# Altium schematic sheet HW_Control.SchDoc
size A4; DocumentNumber: 7; SheetNumber: 7; SheetTotal: 11
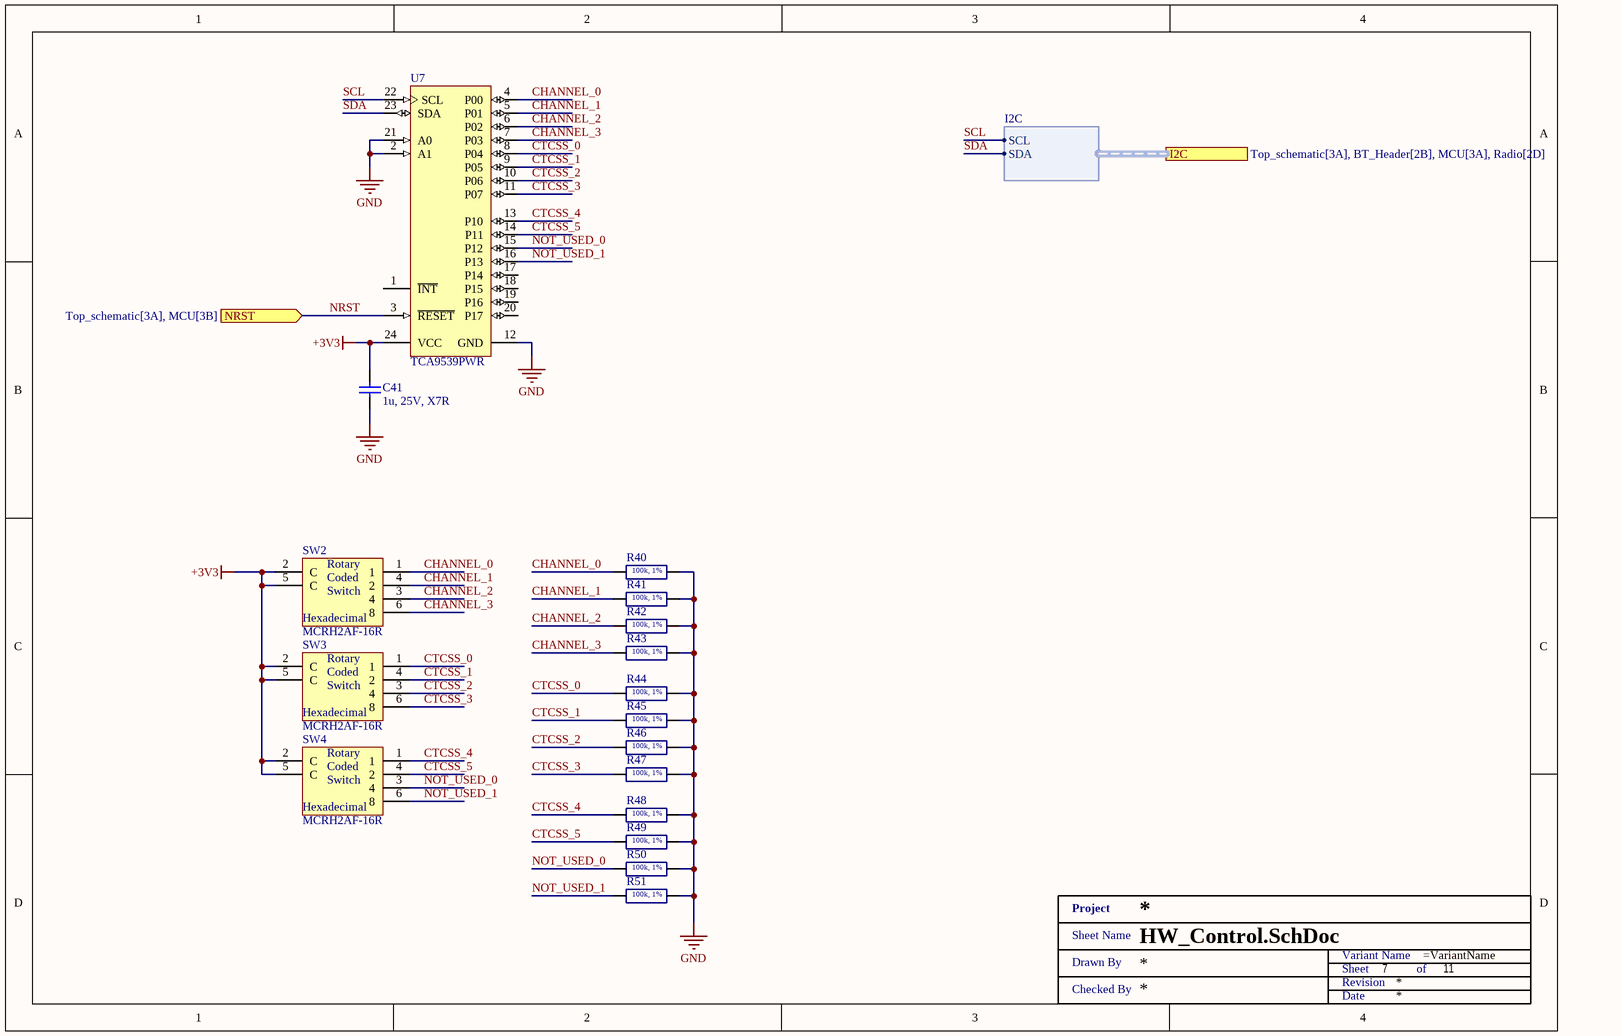
[diagram p0: HW_Control.SchDoc]

## Parts
C41  1u, 25V, X7R  [SMD0603]
R40  100k, 1%  [SMD0603 - R]
R41  100k, 1%  [SMD0603 - R]
R42  100k, 1%  [SMD0603 - R]
R43  100k, 1%  [SMD0603 - R]
R44  100k, 1%  [SMD0603 - R]
R45  100k, 1%  [SMD0603 - R]
R46  100k, 1%  [SMD0603 - R]
R47  100k, 1%  [SMD0603 - R]
R48  100k, 1%  [SMD0603 - R]
R49  100k, 1%  [SMD0603 - R]
R50  100k, 1%  [SMD0603 - R]
R51  100k, 1%  [SMD0603 - R]
SW2  MCRH2AF-16R  [MCRH-16]
SW3  MCRH2AF-16R  [MCRH-16]
SW4  MCRH2AF-16R  [MCRH-16]
U7  TCA9539PWR  [PW0024A_M]
XX?  Title 1  (value not drawn)  (graphical)

## Ports
I2C (harness I2C, see Top_schematic[3A], BT_Header[2B], MCU[3A], Radio[2D]), NRST (in, see Top_schematic[3A], MCU[3B])

## Harnesses
I2C: SCL, SDA

## Nets
+3V3: C41.1 SW2.2(C) SW2.5(C) SW3.2(C) SW3.5(C) SW4.2(C) SW4.5(C) U7.24(VCC)
GND: C41.2 R40.1 R41.1 R42.1 R43.1 R44.1 R45.1 R46.1 R47.1 R48.1 R49.1 R50.1 R51.1 U7.2(A1) U7.12(GND) U7.21(A0)
CHANNEL_0: R40.2 SW2.1 U7.4(P00)
CHANNEL_1: R41.2 SW2.4(2) U7.5(P01)
CHANNEL_2: R42.2 SW2.3(4) U7.6(P02)
CHANNEL_3: R43.2 SW2.6(8) U7.7(P03)
CTCSS_0: R44.2 SW3.1 U7.8(P04)
CTCSS_1: R45.2 SW3.4(2) U7.9(P05)
CTCSS_2: R46.2 SW3.3(4) U7.10(P06)
CTCSS_3: R47.2 SW3.6(8) U7.11(P07)
CTCSS_4: R48.2 SW4.1 U7.13(P10)
CTCSS_5: R49.2 SW4.4(2) U7.14(P11)
NOT_USED_0: R50.2 SW4.3(4) U7.15(P12)
NOT_USED_1: R51.2 SW4.6(8) U7.16(P13)
NRST: U7.3(~{RESET}) ; port NRST
SCL: U7.22(SCL) ; port I2C.SCL
SDA: U7.23(SDA) ; port I2C.SDA

Not connected (* = marked no-connect by the designer): U7 1(~{INT}) 17(P14) 18(P15) 19(P16) 20(P17)

## Notes on the sheet
- (in symbol MCRH2AF-16R) Rotary; Coded; Switch; Hexadecimal
- (in symbol Title 1) Project; Sheet Name; Variant Name; Drawn By; Sheet; of; Revision; Checked By; Date

## Library data of the parts
C41 = CGA3E1X7R1E105K080AC: CAP CER 1UF 25V X7R 0603; Manufacturer: TDK Corporation; Tolerance: ±10%; Manufacturer Part Number: CGA3E1X7R1E105K080AC; RoHS: RoHS Compliant; Category: Capacitors; Stock 1: 109509; Pricing 1: 1=0.2, 10=0.135, 100=0.0686, 500=0.04696, 1000=0.04154 (USD); Packaging: Cut Tape (CT); Part Status: Active; Voltage - Rated: 25V; Temperature Coefficient: X7R; Operating Temperature: -55°C ~ 125°C; Features: -; Ratings: AEC-Q200; Applications: Automotive; Failure Rate: -; Mounting Type: Surface Mount, MLCC; Package / Case: 0603 (1608 Metric); Size / Dimension: 0.063" L x 0.032" W (1.60mm x 0.80mm); Height - Seated (Max): -; Thickness (Max): 0.035" (0.90mm); Lead Spacing: -; Lead Style: -; ComponentLink1URL: https://product.tdk.com/info/en/catalog/datasheets/mlcc_automotive_general_en.pdf; ComponentLink1Description: https://product.tdk.com/info/en/catalog/datasheets/mlcc_automotive_general_en.pdf; Capacitance: 1u; Supplier 1: Mouser; Supplier Part Number 1: 810-CGA3E1X7R1E105K; Supplier 2: Farnell; Supplier Part Number 2: 2346962; Supplier 3: Digi-Key; Supplier Part Number 3: 445-6931-1-ND
R40-R51 = RC0603FR-07100KL: RES SMD 100K OHM 1% 1/10W 0603; Manufacturer: Yageo; Power (Watts): 0.1W, 1/10W; Temperature Coefficient: ±100ppm/°C; Manufacturer Part Number: RC0603FR-07100KL; RoHS: RoHS Compliant; Category: Resistors; Stock 1: 14618646; Pricing 1: 1=0.1, 10=0.015, 100=0.006, 1000=0.00268, 2500=0.00233 (USD); Packaging: Cut Tape (CT); Part Status: Active; Tolerance: ±1%; Composition: Thick Film; Features: Moisture Resistant; Operating Temperature: -55°C ~ 155°C; Package / Case: 0603 (1608 Metric); Supplier Device Package: 0603; Size / Dimension: 0.063" L x 0.032" W (1.60mm x 0.80mm); Height - Seated (Max): 0.022" (0.55mm); Failure Rate: -; ComponentLink1URL: http://www.yageo.com/documents/recent/PYu-RC_Group_51_RoHS_L_8.pdf; ComponentLink1Description: http://www.yageo.com/documents/recent/PYu-RC_Group_51_RoHS_L_8.pdf; Resistance: 100k; Supplier 1: Mouser; Supplier Part Number 1: 603-RC0603FR-07100KL; Supplier 2: Farnell; Supplier Part Number 2: 9238727; Supplier 3: Digi-Key; Supplier Part Number 3: 311-100KHRCT-ND
SW2-SW4 = MCRH2AF-16R: Rotary Coded Switch Hexadecimal – MCRH Series 10 × 10mm, Through Hole; Manufacturer: Multicomp; Supplier 1: Farnell; Supplier Part Number 1: 1522033; Manufacturer Part Number: MCRH2AF-16R; RoHS: Yes; Stock 1: 789; ComponentLink1URL: https://datasheet.ciiva.com/6800/389223-6800880.pdf?src-supplier=Newark; ComponentLink1Description: https://datasheet.ciiva.com/6800/389223-6800880.pdf?src-supplier=Newark; ComponentLink2URL: https://datasheet.ciiva.com/1531/1520809-1531931.pdf?src-supplier=Element14; ComponentLink2Description: https://datasheet.ciiva.com/1531/1520809-1531931.pdf?src-supplier=Element14; Supplier 2: Newark; Supplier Part Number 2: 74M3034
U7 = CMP-0314-00251-2: Remote 16-Bit I2C and SMBus, Low-Power I/O Expander with Interrupt Output, Reset & Config. Register, 1.65 to 5.5 V, -40 to 85 degC, 24-pin TSSOP (PW), Green (RoHS & no Sb/Br); Manufacturer: Texas Instruments; Interrupt Output: Yes; SubFamily: I2C IO Expander; I2C Address: 1110 1xx; # of I/Os: 16; Max Frequency(kHz): 400; 5V Tolerant I/O: Yes; ComponentLink1Description: Datasheet; PartNumber: TCA9539PWR; Eco-Plan: Green (RoHS & no Sb/Br); Reset Input: Yes; ComponentLink2Description: Package Specification; Mounting Technology: Surface Mount; PackageReference: PW0024A; DatasheetVersion: SCPS202A; ComponentLink1URL: http://www.ti.com/general/docs/lit/getliterature.tsp?genericPartNumber=TCA9539&fileType=pdf; Vcc range(V): 1.65 to 5.5; Low Power: Yes; Code_JEDEC: MO-153; Configuration Registers: Yes; PackageVersion: revG, Feb-2011; PackageDescription: 24-Pin Thin Small Outline Package 0.65 mm Pitch; Push-Pull I/O Type: Yes; ComponentLink2URL: http://www.ti.com/litv/pdf/mpds177g